# Altium schematic sheet Terminals.SchDoc
size 297 x 209 mm; SheetNumber: 1; SheetTotal: 29
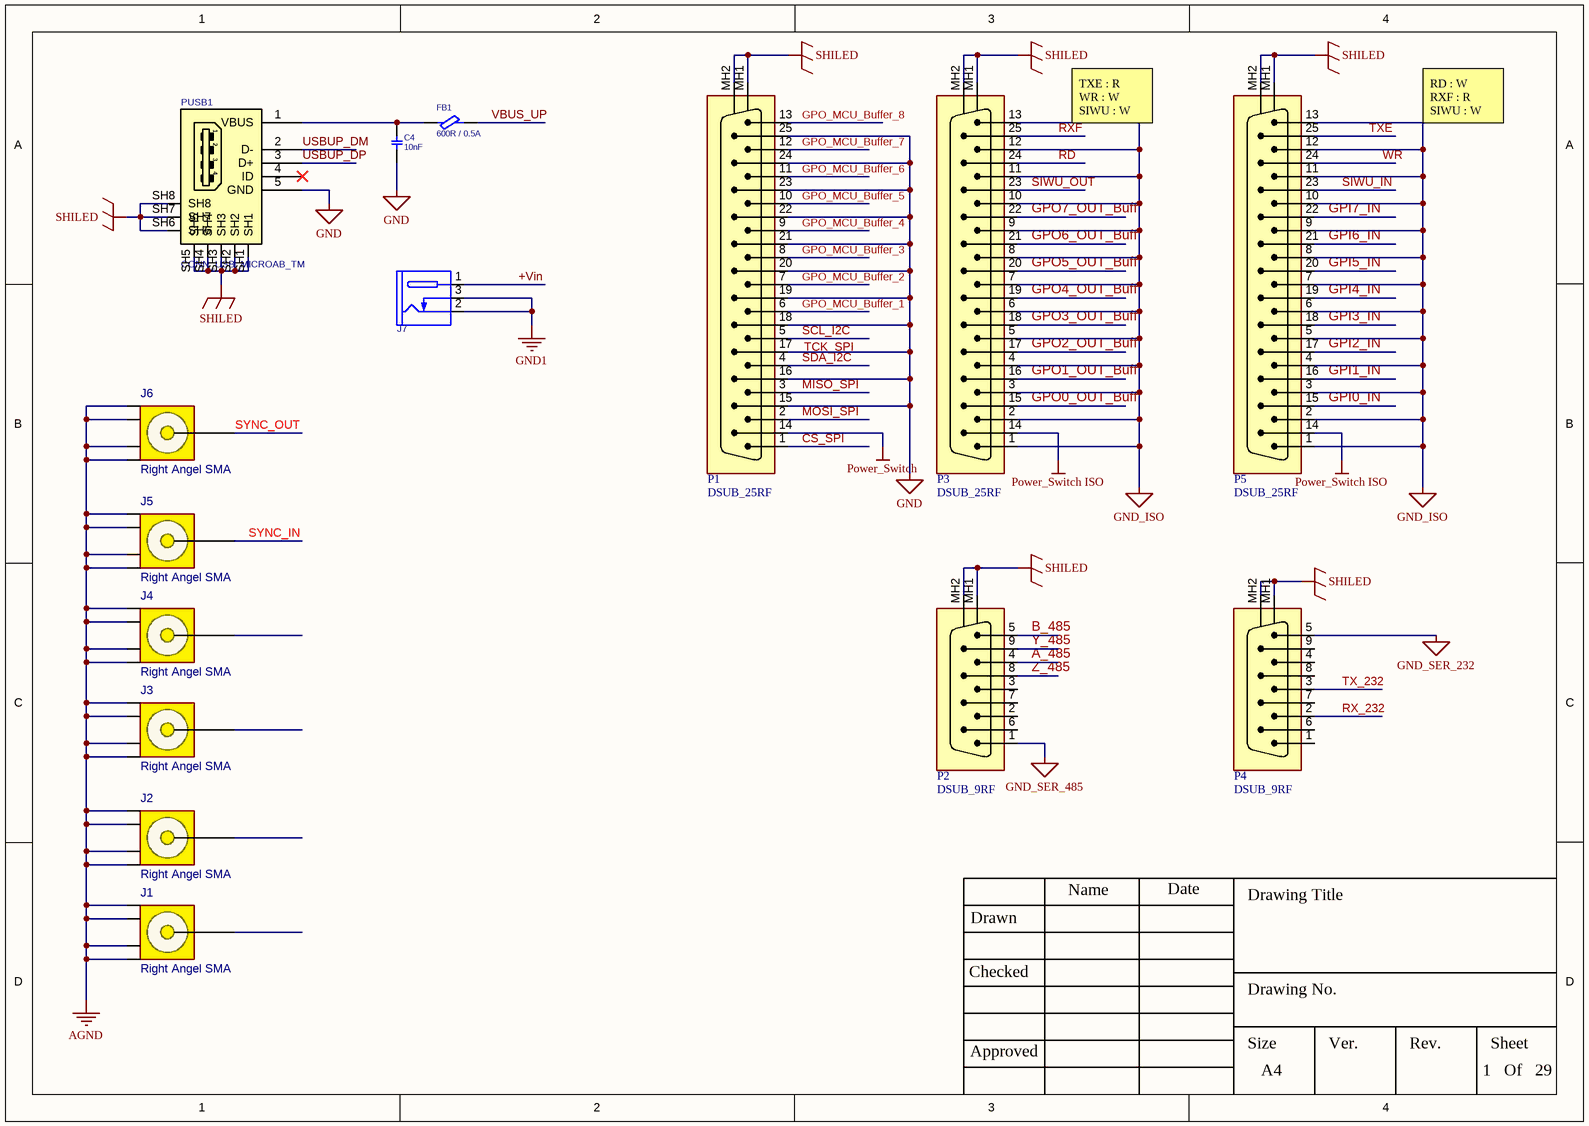
[diagram p0: Terminals.SchDoc]

## Parts
C4  10nF  [C0603]
FB1  600R / 0.5A  [L0603]
J1  Right Angel SMA  [SMA_RA]
J2  Right Angel SMA  [SMA_RA]
J3  Right Angel SMA  [SMA_RA]
J4  Right Angel SMA  [SMA_RA]
J5  Right Angel SMA  [SMA_RA]
J6  Right Angel SMA  [SMA_RA]
J7  DC_POWER_JACK  [JAC_PWR2]  (value not drawn)
P1  DSUB_25RF  [DSUB_25RF]
P2  DSUB_9RF  [DSUB_9RF]
P3  DSUB_25RF  [DSUB_25RF]
P4  DSUB_9RF  [DSUB_9RF]
P5  DSUB_25RF  [DSUB_25RF]
PUSB1  CONN_USB_MICROAB_TM  [USB_MICRO_AB_TM_SHT]

## Nets
AGND: J1.2(G1) J1.3(G2) J1.4(G3) J1.5(G4) J2.2(G1) J2.3(G2) J2.4(G3) J2.5(G4) J3.2(G1) J3.3(G2) J3.4(G3) J3.5(G4) J4.2(G1) J4.3(G2) J4.4(G3) J4.5(G4) J5.2(G1) J5.3(G2) J5.4(G3) J5.5(G4) J6.2(G1) J6.3(G2) J6.4(G3) J6.5(G4)
GND: C4.1 P1.15 P1.16 P1.17 P1.18 P1.19 P1.20 P1.21 P1.22 P1.23 P1.24 P1.25 PUSB1.5(GND)
GND1: J7.2(SLEEVE) J7.3(INSERTION_DET)
GND_ISO: P3.1 P3.2 P3.3 P3.4 P3.5 P3.6 P3.7 P3.8 P3.9 P3.10 P3.11 P3.12 P3.13 P5.1 P5.2 P5.3 P5.4 P5.5 P5.6 P5.7 P5.8 P5.9 P5.10 P5.11 P5.12 P5.13
GND_SER_232: P4.5
GND_SER_485: P2.1
Power_Switch: P1.14
Power_Switch ISO: P3.14 P5.14
SHILED: P1.MH1 P1.MH2 P2.MH1 P2.MH2 P3.MH1 P3.MH2 P4.MH1 P4.MH2 P5.MH1 P5.MH2 PUSB1.SH1 PUSB1.SH2 PUSB1.SH3 PUSB1.SH4 PUSB1.SH5 PUSB1.SH6 PUSB1.SH7 PUSB1.SH8
+Vin: J7.1(TIP)
A_485: P2.4
B_485: P2.5
CS_SPI: P1.1
GPI0_IN: P5.15
GPI1_IN: P5.16
GPI2_IN: P5.17
GPI3_IN: P5.18
GPI4_IN: P5.19
GPI5_IN: P5.20
GPI6_IN: P5.21
GPI7_IN: P5.22
GPO0_OUT_Buff: P3.15
GPO1_OUT_Buff: P3.16
GPO2_OUT_Buff: P3.17
GPO3_OUT_Buff: P3.18
GPO4_OUT_Buff: P3.19
GPO5_OUT_Buff: P3.20
GPO6_OUT_Buff: P3.21
GPO7_OUT_Buff: P3.22
GPO_MCU_Buffer_1: P1.6
GPO_MCU_Buffer_2: P1.7
GPO_MCU_Buffer_3: P1.8
GPO_MCU_Buffer_4: P1.9
GPO_MCU_Buffer_5: P1.10
GPO_MCU_Buffer_6: P1.11
GPO_MCU_Buffer_7: P1.12
GPO_MCU_Buffer_8: P1.13
MISO_SPI: P1.3
MOSI_SPI: P1.2
~{RD}: P3.24
~{RXF}: P3.25
RX_232: P4.2
SCL_I2C: P1.5  [also labelled TCK_SPI]
SDA_I2C: P1.4
SIWU_IN: P5.23
SIWU_OUT: P3.23
SYNC_IN: J5.1(SIG)
SYNC_OUT: J6.1(SIG)
~{TXE}: P5.25
TX_232: P4.3
USBUP_DM: PUSB1.2(D-)
USBUP_DP: PUSB1.3(D+)
VBUS_UP: FB1.2
~{WR}: P5.24
Y_485: P2.9
Z_485: P2.8
NetC4_2: C4.2 FB1.1 PUSB1.1(VBUS)

Not connected (* = marked no-connect by the designer): J1 1(SIG); J2 1(SIG); J3 1(SIG); J4 1(SIG); P2 2 3 6 7; P4 1 4 6 7 8 9; PUSB1 4(ID)*

## Notes on the sheet
- TXE : R
  WR : W
  SIWU : W
- RD : W
  RXF : R
  SIWU : W
- Drawn
- Name
- Date
- Drawing Title
- Checked
- Drawing No.
- Approved
- Size
- A4
- Ver.
- Rev.
- Sheet
- Of

## Library data of the parts
C4 = CAP_SMD_MLCC_10u16V: CAP, MLCC, X5R, 10uF, 10%, 16V, 0603; MANF_P#: GRT188R61C106KE13D; MANF: Murata; PARAM: X5R, 10%, -55~85°C; PARAM2: 16V; PRICE: 100= 20$; VALUE: 10nF
FB1 = FBEAD_SMD_MPZ1608S102: FERRITE_Bead, 0603, 0.8A, 300mOhm, 1000@100MHz; MANF: TDK; MANF_P#: MPZ1608S102ATA00; PARAM: 1000@100MHz; PARAM2: 0.8A; PRICE: 100= 3.4$; VALUE: 600R / 0.5A
J1-J6 = CONN_RF_SMA_RA: CONN, RF, SMA, Right Angle; MANF_P#: SMA-J-P-H-RA-TH1; MANF: Samtec; PARAM: 50Ohm, 20GHz; DESC: DESCRIPTION; DIST#: DIGIKEY; PARAM2: GOLD; ASSEMBLY: ASSEMBLY; PRICE: 6.3$; VALUE: Right Angel SMA
J7 = CONN_PWR_JACKR2: CONN, PWR JACK DC, PLUG DIAM 2.0MM RA THD; MANF: CUI STACK; MANF_P#: PJ-202A, PJ-002AH, PJ-102AH, KLDX-0202; VALUE: DC_POWER_JACK
P1 P3 P5 = CONN_DSUB_25RF: CONN, DSUB, HD, 25PIN, R/A, FEMALE, THD; MANF_P#: -; MANF: -; VALUE: DSUB_25RF
P2 P4 = CONN_DSUB_9RF: CONN, DSUB, HD, 9PIN, R/A, FEMALE, THD; MANF_P#: -; MANF: -; VALUE: DSUB_9RF
PUSB1 = CONN_USB_MICRO_AB_TM_SHT: CONN, USB, MICRO AB, R/A, SMD, TOP MOUNT; MANF_P#: 47590-0001; MANF: MOLEX; PARAM2: 30VAC; PARAM: 1.8A, -20~85oC; PRICE: 0.75$; VALUE: CONN_USB_MICROAB_TM